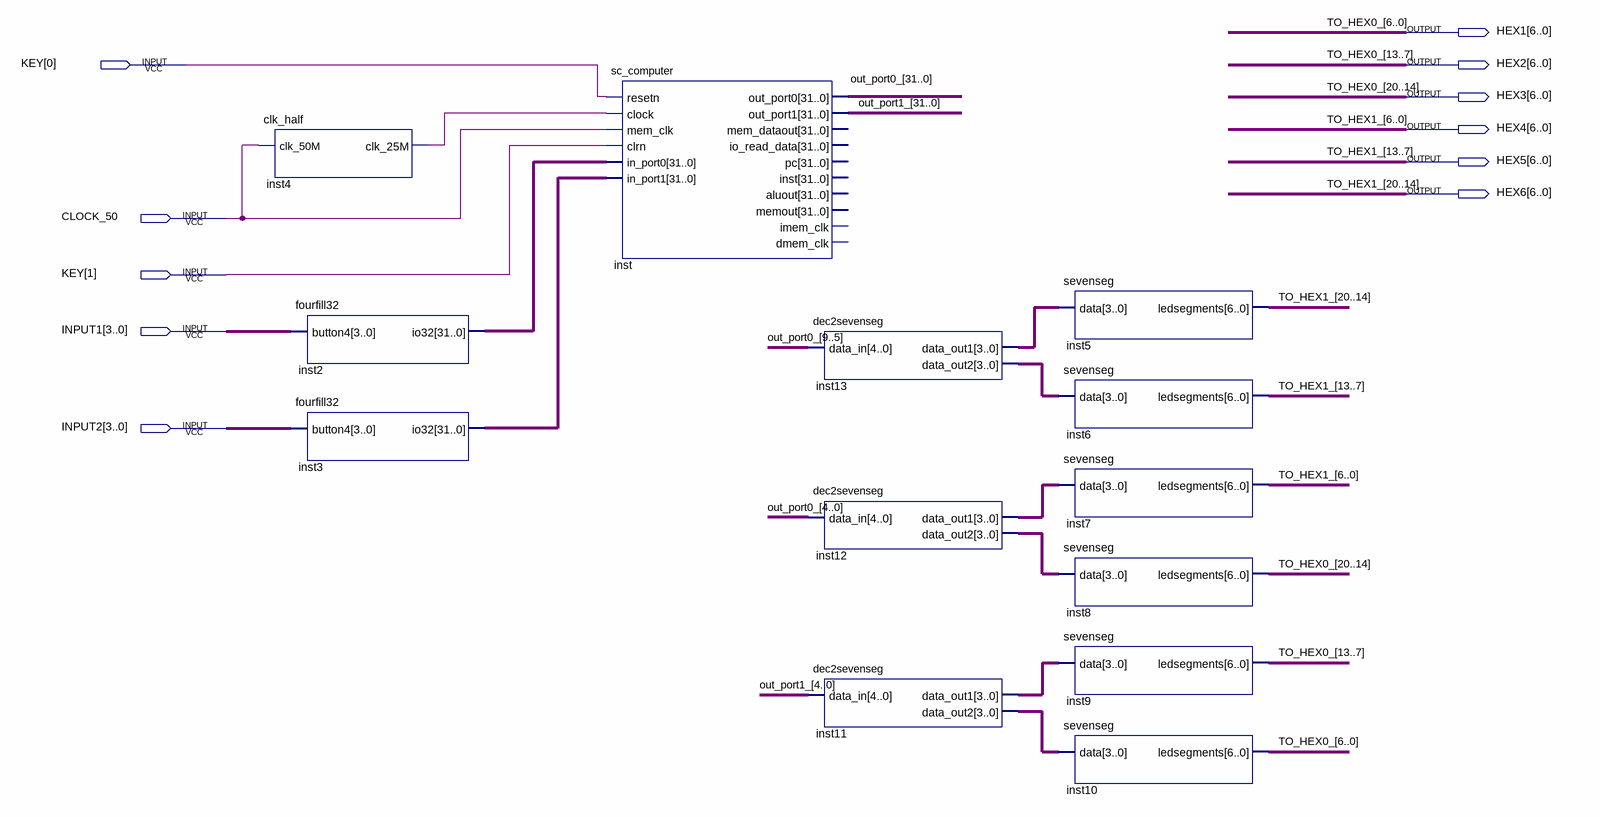
[diagram p0: schematic sheet]
// Quartus schematic main.bdf as structural Verilog: 13 symbols, 11 pins
module main (
  input  [1:0] KEY,
  input  CLOCK_50,
  input  [3:0] INPUT1,
  input  [3:0] INPUT2,
  output [6:0] HEX1,
  output [6:0] HEX2,
  output [6:0] HEX3,
  output [6:0] HEX4,
  output [6:0] HEX5,
  output [6:0] HEX6
);

  wire inst4_clk_25m;
  wire [3:0] inst11_data_out1, inst11_data_out2, inst12_data_out1, inst12_data_out2, inst13_data_out1,
       inst13_data_out2;
  wire [31:0] inst2_io32, inst3_io32, out_port0_, out_port1_;

  clk_half inst4 (.clk_50M(CLOCK_50), .clk_25M(inst4_clk_25m));
  fourfill32 inst2 (.button4(INPUT1), .io32(inst2_io32));
  fourfill32 inst3 (.button4(INPUT2), .io32(inst3_io32));
  sc_computer inst (
    .resetn(KEY[0]), .clock(inst4_clk_25m), .mem_clk(CLOCK_50), .clrn(KEY[1]), .in_port0(inst2_io32),
    .in_port1(inst3_io32), .out_port0(out_port0_), .out_port1(out_port1_));  // open: mem_dataout, io_read_data, pc, inst, aluout, memout, imem_clk, dmem_clk
  dec2sevenseg inst13 (.data_in(out_port0_[9:5]), .data_out1(inst13_data_out1), .data_out2(inst13_data_out2));
  dec2sevenseg inst12 (.data_in(out_port0_[4:0]), .data_out1(inst12_data_out1), .data_out2(inst12_data_out2));
  dec2sevenseg inst11 (.data_in(out_port1_[4:0]), .data_out1(inst11_data_out1), .data_out2(inst11_data_out2));
  sevenseg inst5 (.data(inst13_data_out1), .ledsegments(HEX6));
  sevenseg inst6 (.data(inst13_data_out2), .ledsegments(HEX5));
  sevenseg inst7 (.data(inst12_data_out1), .ledsegments(HEX4));
  sevenseg inst8 (.data(inst12_data_out2), .ledsegments(HEX3));
  sevenseg inst9 (.data(inst11_data_out1), .ledsegments(HEX2));
  sevenseg inst10 (.data(inst11_data_out2), .ledsegments(HEX1));

  // Other names for the same wires on the sheet: TO_HEX0_[20:0] = {HEX3, HEX2, HEX1};
  //   TO_HEX1_[20:0] = {HEX6, HEX5, HEX4}
endmodule
